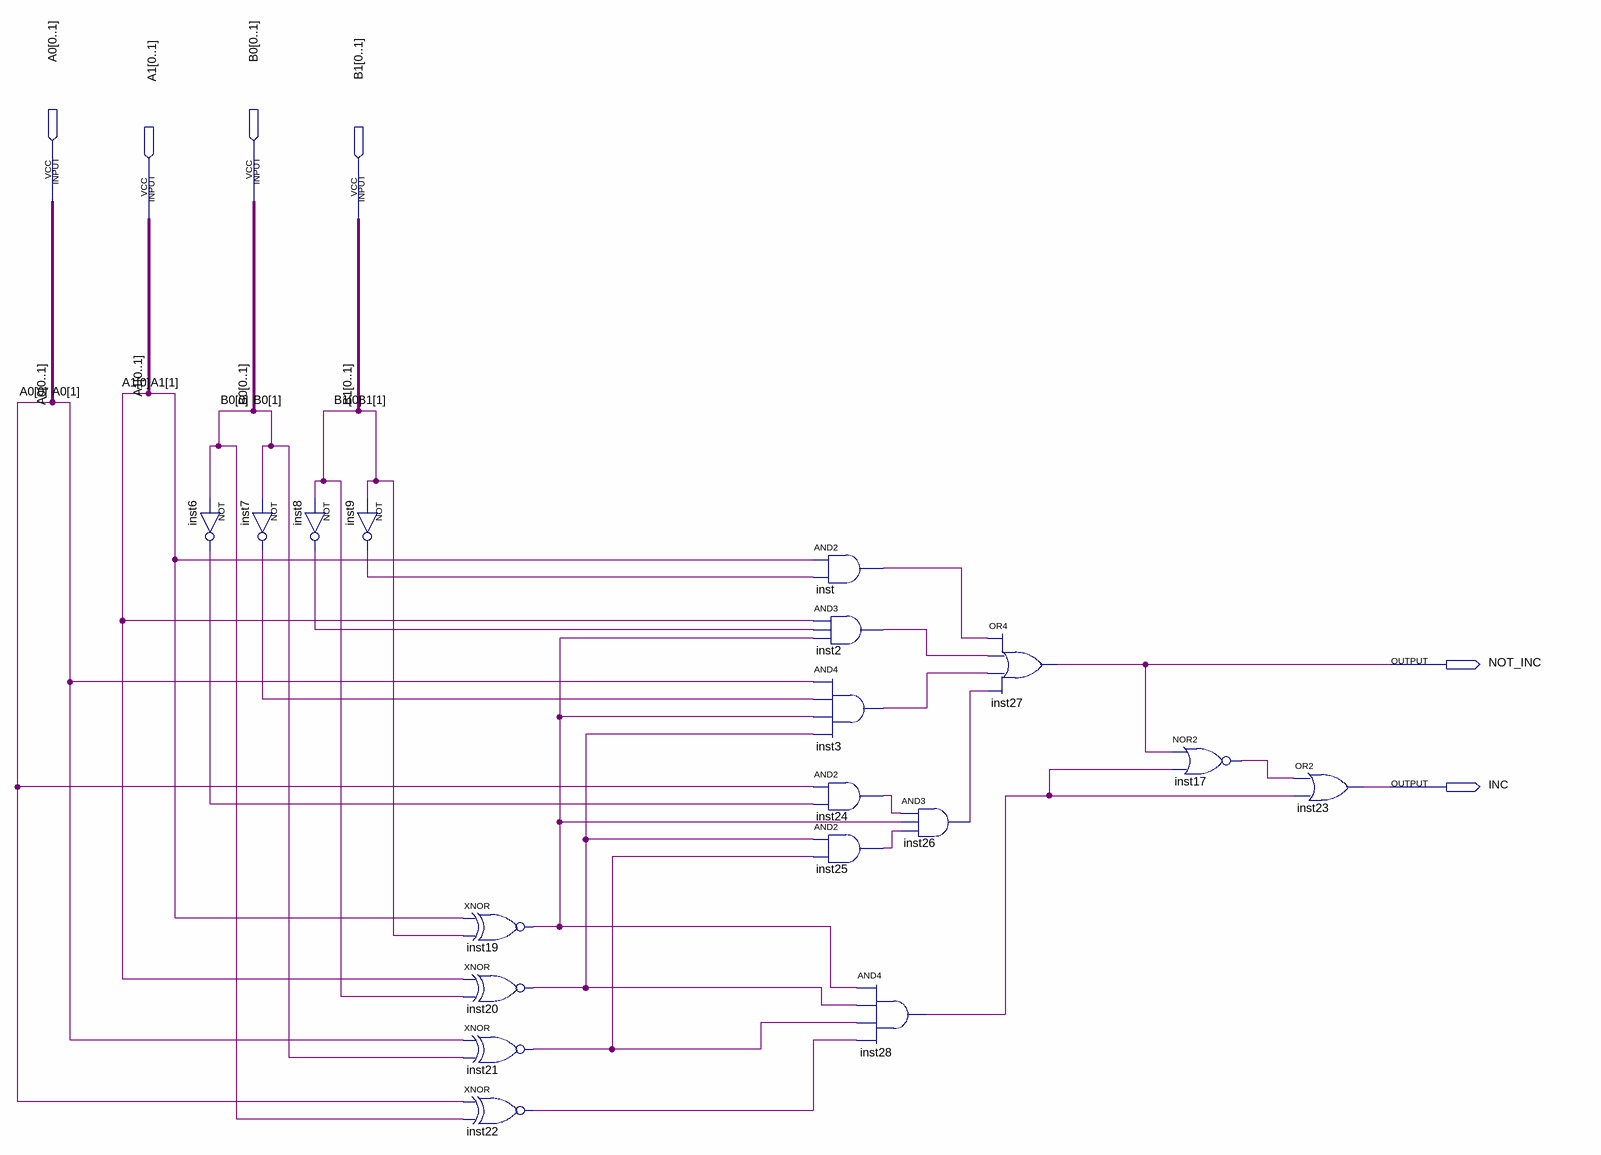
[diagram p0: schematic sheet]
// Quartus schematic StepB.bdf as structural Verilog: 18 symbols, 6 pins
module StepB (
  input  [0:1] A0,
  input  [0:1] B0,
  input  [0:1] A1,
  input  [0:1] B1,
  output NOT_INC,
  output INC
);

  wire inst2_out, inst3_out, inst6_out, inst7_out, inst8_out, inst9_out, inst17_out, inst19_out, inst20_out,
       inst21_out, inst22_out, inst24_out, inst25_out, inst26_out, inst28_out, inst_out;

  not inst6 (inst6_out, B0[0]);
  not inst7 (inst7_out, B0[1]);
  not inst8 (inst8_out, B1[0]);
  not inst9 (inst9_out, B1[1]);
  xnor inst19 (inst19_out, A1[1], B1[1]);
  xnor inst20 (inst20_out, A1[0], B1[0]);
  xnor inst21 (inst21_out, A0[1], B0[1]);
  xnor inst22 (inst22_out, A0[0], B0[0]);
  and inst (inst_out, A1[1], inst9_out);
  and inst2 (inst2_out, A1[0], inst8_out, inst19_out);
  and inst3 (inst3_out, A0[1], inst7_out, inst19_out, inst20_out);
  and inst24 (inst24_out, A0[0], inst6_out);
  and inst25 (inst25_out, inst20_out, inst21_out);
  and inst28 (inst28_out, inst19_out, inst20_out, inst21_out, inst22_out);
  and inst26 (inst26_out, inst24_out, inst19_out, inst25_out);
  or inst27 (NOT_INC, inst_out, inst2_out, inst3_out, inst26_out);
  nor inst17 (inst17_out, NOT_INC, inst28_out);
  or inst23 (INC, inst17_out, inst28_out);
endmodule
